# Altium project 73 VALIANT INDICATOR.PrjPcb
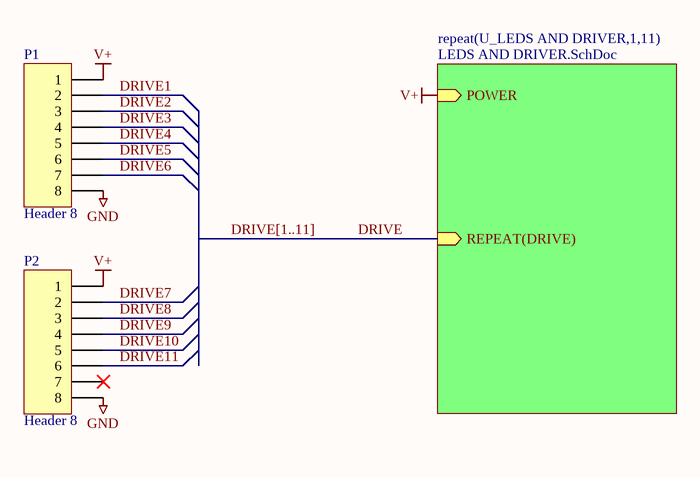
[diagram p0: INDICATOR.SchDoc]
2 sheets, 90 parts. Net scope: hierarchical (ports join the sheet entries above them; power ports are global).
Board file: INDICATOR.PcbDoc
Sheets:
  INDICATOR.SchDoc
    U_LEDS AND DRIVER1 = LEDS AND DRIVER.SchDoc
    U_LEDS AND DRIVER2 = LEDS AND DRIVER.SchDoc
    U_LEDS AND DRIVER3 = LEDS AND DRIVER.SchDoc
    U_LEDS AND DRIVER4 = LEDS AND DRIVER.SchDoc
    U_LEDS AND DRIVER5 = LEDS AND DRIVER.SchDoc
    U_LEDS AND DRIVER6 = LEDS AND DRIVER.SchDoc
    U_LEDS AND DRIVER7 = LEDS AND DRIVER.SchDoc
    U_LEDS AND DRIVER8 = LEDS AND DRIVER.SchDoc
    U_LEDS AND DRIVER9 = LEDS AND DRIVER.SchDoc
    U_LEDS AND DRIVER10 = LEDS AND DRIVER.SchDoc
    U_LEDS AND DRIVER11 = LEDS AND DRIVER.SchDoc

## Sheet INDICATOR.SchDoc
size A4

### Parts
P1  Header 8  [HDR1X8]
P2  Header 8  [HDR1X8]

### Sub-sheets
repeat(U_LEDS AND DRIVER,1,11) = LEDS AND DRIVER.SchDoc: POWER (in), REPEAT(DRIVE) (in)

### Nets
GND: P1.8 P2.8
V+: P1.1 P2.1 ; sheet repeat(U_LEDS AND DRIVER,1,11)/POWER
DRIVE: sheet repeat(U_LEDS AND DRIVER,1,11)/REPEAT(DRIVE)
DRIVE1: P1.2
DRIVE2: P1.3
DRIVE3: P1.4
DRIVE4: P1.5
DRIVE5: P1.6
DRIVE6: P1.7
DRIVE7: P2.2
DRIVE8: P2.3
DRIVE9: P2.4
DRIVE10: P2.5
DRIVE11: P2.6

Not connected (* = marked no-connect by the designer): P2 7*

### Buses and harness runs
bus DRIVE[1..11]

### Library data of the parts
P1 P2 = Header 8: Header, 8-Pin; LatestRevisionDate: 17-Jul-2002; LatestRevisionNote: Re-released for DXP Platform.; Publisher: Altium Limited

## Sheet LEDS AND DRIVER.SchDoc
size A4
Used 11 times, as channels U_LEDS AND DRIVER1, U_LEDS AND DRIVER2, U_LEDS AND DRIVER3, U_LEDS AND DRIVER4, U_LEDS AND DRIVER5, U_LEDS AND DRIVER6, U_LEDS AND DRIVER7, U_LEDS AND DRIVER8, U_LEDS AND DRIVER9, U_LEDS AND DRIVER10, U_LEDS AND DRIVER11. Parts and nets are listed once, with the designators drawn on the sheet.
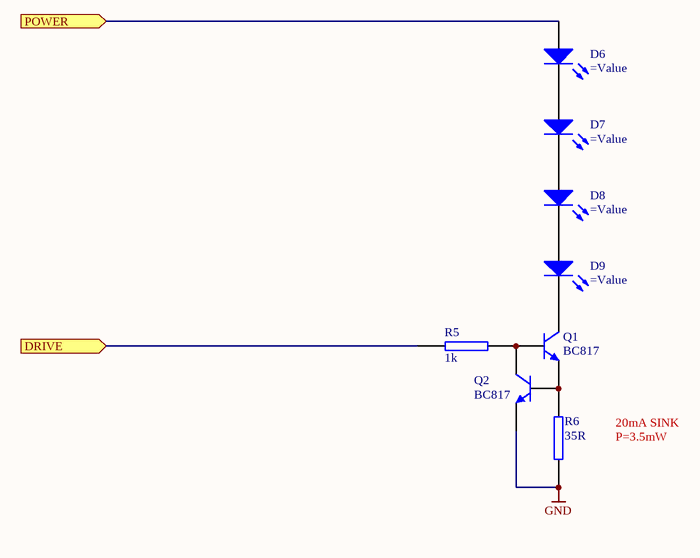
[diagram p1: LEDS AND DRIVER.SchDoc]

### Parts
D6  (no value)  [LED SUPERFLUX AMBER]
D7  (no value)  [LED SUPERFLUX AMBER]
D8  (no value)  [LED SUPERFLUX AMBER]
D9  (no value)  [LED SUPERFLUX AMBER]
Q1  BC817  [SOT23-3L]
Q2  BC817  [SOT23-3L]
R5  1k  [RES (3D) - 0805]
R6  35R  [RES (3D) - 0805]

### Ports
DRIVE (in), POWER (in)

### Nets
GND: Q2.2(E) R6.1
DRIVE: R5.2 ; port DRIVE
POWER: D6.1(A) ; port POWER
NetD6_2: D6.2(K) D7.1(A)
NetD7_2: D7.2(K) D8.1(A)
NetD8_2: D8.2(K) D9.1(A)
NetD9_2: D9.2(K) Q1.3(C)
NetQ1_1: Q1.1(B) Q2.3(C) R5.1
NetQ1_2: Q1.2(E) Q2.1(B) R6.2

### Channels
U_LEDS AND DRIVER1: designators end in A; ports DRIVE=DRIVE1 POWER=V+
U_LEDS AND DRIVER2: designators end in B; ports DRIVE=DRIVE2 POWER=V+
U_LEDS AND DRIVER3: designators end in C; ports DRIVE=DRIVE3 POWER=V+
U_LEDS AND DRIVER4: designators end in D; ports DRIVE=DRIVE4 POWER=V+
U_LEDS AND DRIVER5: designators end in E; ports DRIVE=DRIVE5 POWER=V+
U_LEDS AND DRIVER6: designators end in F; ports DRIVE=DRIVE6 POWER=V+
U_LEDS AND DRIVER7: designators end in G; ports DRIVE=DRIVE7 POWER=V+
U_LEDS AND DRIVER8: designators end in H; ports DRIVE=DRIVE8 POWER=V+
U_LEDS AND DRIVER9: designators end in I; ports DRIVE=DRIVE9 POWER=V+
U_LEDS AND DRIVER10: designators end in J; ports DRIVE=DRIVE10 POWER=V+
U_LEDS AND DRIVER11: designators end in K; ports DRIVE=DRIVE11 POWER=V+

### Notes on the sheet
- 20mA SINK
- P=3.5mW

### Library data of the parts
D6-D9 = LED 3mm RED: LED 55
Q1 Q2 = BC817: NPN Bipolar Transistor; Manufacturer: ON Semiconductor; Manufacturer Part No.: BC817-25LT1G; Revision: July-2002: Re-released for DXP Platform.; Mouser Part no.: 863-BC817-25LT1G; Farnell Part no.: 1081223; value: BC817; Web link: http://au.mouser.com/ProductDetail/ON-Semiconductor/BC817-25LT1G/?qs=sGAEpiMZZMutXGli8Ay4kJTaSFKHrKTHz5OxB%252bfaCCM%3d
R5 R6 = RES SMD 0603 1k: RESISTOR SMD 0603 1k
  R5: value: 1k
  R6: value: 35R

## Nets that join several sheets
GND: INDICATOR (P1.8 P2.8), U_LEDS AND DRIVER1 (Q2A.2 R6A.1), U_LEDS AND DRIVER2 (Q2B.2 R6B.1), U_LEDS AND DRIVER3 (Q2C.2 R6C.1), U_LEDS AND DRIVER4 (Q2D.2 R6D.1), U_LEDS AND DRIVER5 (Q2E.2 R6E.1), U_LEDS AND DRIVER6 (Q2F.2 R6F.1), U_LEDS AND DRIVER7 (Q2G.2 R6G.1), U_LEDS AND DRIVER8 (Q2H.2 R6H.1), U_LEDS AND DRIVER9 (Q2I.2 R6I.1), U_LEDS AND DRIVER10 (Q2J.2 R6J.1), U_LEDS AND DRIVER11 (Q2K.2 R6K.1)
V+: INDICATOR (P1.1 P2.1), U_LEDS AND DRIVER1 (D6A.1), U_LEDS AND DRIVER2 (D6B.1), U_LEDS AND DRIVER3 (D6C.1), U_LEDS AND DRIVER4 (D6D.1), U_LEDS AND DRIVER5 (D6E.1), U_LEDS AND DRIVER6 (D6F.1), U_LEDS AND DRIVER7 (D6G.1), U_LEDS AND DRIVER8 (D6H.1), U_LEDS AND DRIVER9 (D6I.1), U_LEDS AND DRIVER10 (D6J.1), U_LEDS AND DRIVER11 (D6K.1)
DRIVE1: INDICATOR (P1.2), U_LEDS AND DRIVER1 (R5A.2)
DRIVE2: INDICATOR (P1.3), U_LEDS AND DRIVER2 (R5B.2)
DRIVE3: INDICATOR (P1.4), U_LEDS AND DRIVER3 (R5C.2)
DRIVE4: INDICATOR (P1.5), U_LEDS AND DRIVER4 (R5D.2)
DRIVE5: INDICATOR (P1.6), U_LEDS AND DRIVER5 (R5E.2)
DRIVE6: INDICATOR (P1.7), U_LEDS AND DRIVER6 (R5F.2)
DRIVE7: INDICATOR (P2.2), U_LEDS AND DRIVER7 (R5G.2)
DRIVE8: INDICATOR (P2.3), U_LEDS AND DRIVER8 (R5H.2)
DRIVE9: INDICATOR (P2.4), U_LEDS AND DRIVER9 (R5I.2)
DRIVE10: INDICATOR (P2.5), U_LEDS AND DRIVER10 (R5J.2)
DRIVE11: INDICATOR (P2.6), U_LEDS AND DRIVER11 (R5K.2)